# EAGLE design OscillatorShield (EAGLE 7.1.0)
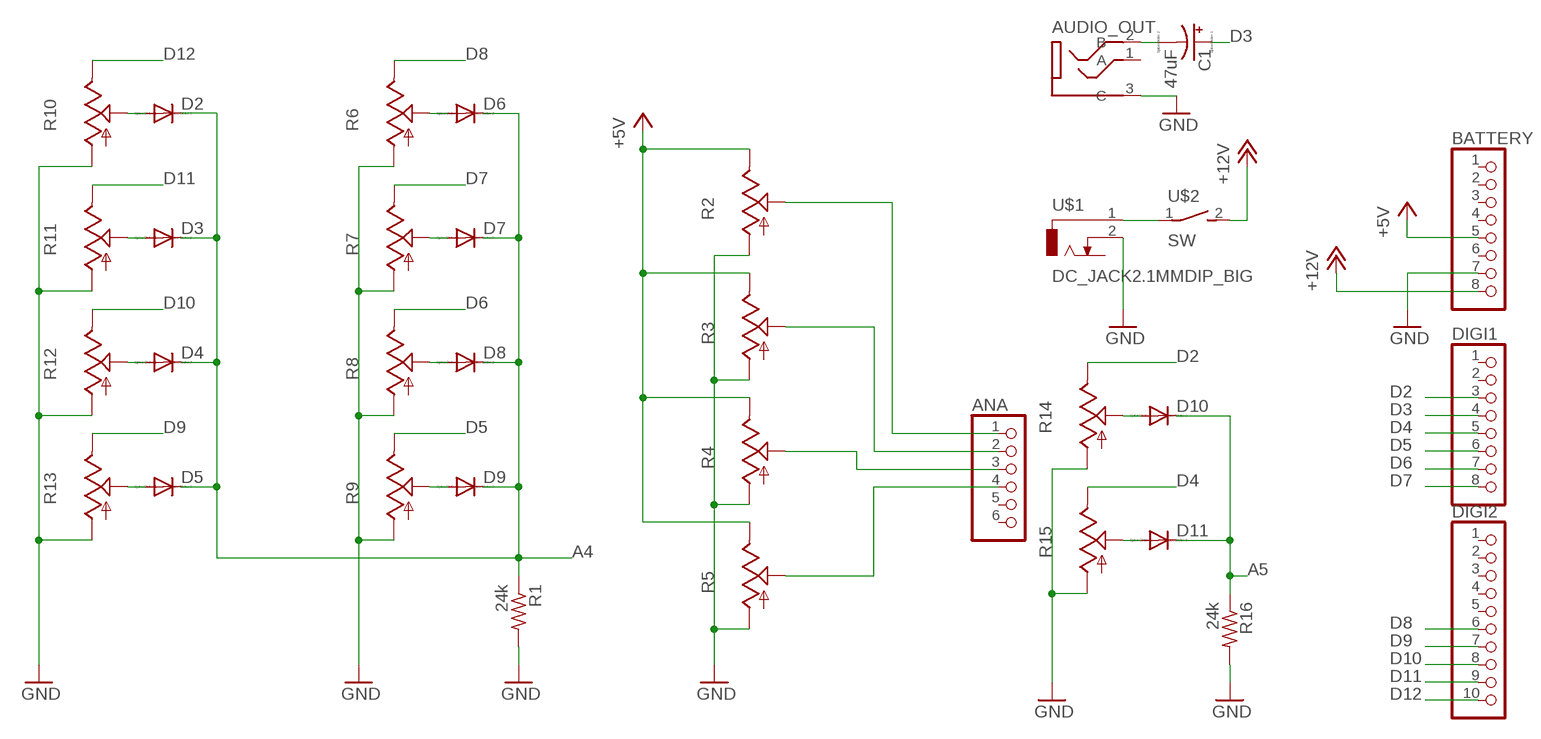
[diagram p0: schematic, sheet 1]

## Parts
ANA  PINHD-1X6  [1X06]
AUDIO_OUT  3CON_3.5MMPLUG  [3PIN_DIP]
BATTERY  PINHD-1X8  [1X08]
C1  47uF  CPOL-USE2.5-6  [E2,5-6]
D2  DIODE-SOD123  [SOD123]
D3  DIODE-SOD123  [SOD123]
D4  DIODE-SOD123  [SOD123]
D5  DIODE-SOD123  [SOD123]
D6  DIODE-SOD123  [SOD123]
D7  DIODE-SOD123  [SOD123]
D8  DIODE-SOD123  [SOD123]
D9  DIODE-SOD123  [SOD123]
D10  DIODE-SOD123  [SOD123]
D11  DIODE-SOD123  [SOD123]
DIGI1  PINHD-1X8  [1X08]
DIGI2  PINHD-1X10  [1X10]
R1  24k  R-US_R1206  [R1206]
R2  TRIM_US-RJ9W  [RJ9W]
R3  TRIM_US-RJ9W  [RJ9W]
R4  TRIM_US-RJ9W  [RJ9W]
R5  TRIM_US-RJ9W  [RJ9W]
R6  TRIM_US-RJ9W  [RJ9W]
R7  TRIM_US-RJ9W  [RJ9W]
R8  TRIM_US-RJ9W  [RJ9W]
R9  TRIM_US-RJ9W  [RJ9W]
R10  TRIM_US-RJ9W  [RJ9W]
R11  TRIM_US-RJ9W  [RJ9W]
R12  TRIM_US-RJ9W  [RJ9W]
R13  TRIM_US-RJ9W  [RJ9W]
R14  TRIM_US-RJ9W  [RJ9W]
R15  TRIM_US-RJ9W  [RJ9W]
R16  24k  R-US_R1206  [R1206]
U$1  DC_JACK2.1MMDIP_BIG  [2PIN_DIP_BIG]
U$2  SW  [2PIN_DIP_BIG]

## Nets
+5V: BATTERY.5 R2.E R3.E R4.E R5.E
+12V: BATTERY.8 U$2.2(S)
A4: D2.C D3.C D4.C D5.C D6.C D7.C D8.C D9.C R1.1
A5: D10.C D11.C R16.1
D2: DIGI1.3 R14.E
D3: C1.+ DIGI1.4
D4: DIGI1.5 R15.E
D5: DIGI1.6 R9.E
D6: DIGI1.7 R8.E
D7: DIGI1.8 R7.E
D8: DIGI2.6 R6.E
D9: DIGI2.7 R13.E
D10: DIGI2.8 R12.E
D11: DIGI2.9 R11.E
D12: DIGI2.10 R10.E
GND: AUDIO_OUT.3(C) BATTERY.7 R1.2 R2.A R3.A R4.A R5.A R6.A R7.A R8.A R9.A R10.A R11.A R12.A R13.A R14.A R15.A R16.2 U$1.2
N$1: ANA.1 R2.S
N$2: ANA.2 R3.S
N$3: ANA.3 R4.S
N$4: ANA.4 R5.S
N$5: D2.A R10.S
N$6: D3.A R11.S
N$7: D4.A R12.S
N$8: D5.A R13.S
N$9: D9.A R9.S
N$10: D8.A R8.S
N$11: D7.A R7.S
N$12: D6.A R6.S
N$13: AUDIO_OUT.2(B) C1.-
N$14: U$1.1 U$2.1(P)
N$17: D11.A R15.S
N$18: D10.A R14.S
Unconnected: ANA.5 ANA.6 AUDIO_OUT.1(A) BATTERY.1 BATTERY.2 BATTERY.3 BATTERY.4 BATTERY.6 DIGI1.1 DIGI1.2 DIGI2.1 DIGI2.2 DIGI2.3 DIGI2.4 DIGI2.5

## Library data of the parts
ANA = pinhead:PINHD-1X6: PIN HEADER
AUDIO_OUT = 02_MyOriginalLib:3CON_3.5MMPLUG
BATTERY DIGI1 = pinhead:PINHD-1X8: PIN HEADER
C1 = 01_EasyAccessLib:CPOL-US: POLARIZED CAPACITOR, American symbol
D2-D11 = 01_EasyAccessLib:DIODE-: DIODE
DIGI2 = pinhead:PINHD-1X10: PIN HEADER
R1 R16 = 01_EasyAccessLib:R-US_: RESISTOR, American symbol
R2-R15 = 01_EasyAccessLib:TRIM_US-: POTENTIOMETER
U$1 = 02_MyOriginalLib:DC_JACK2.1MM
U$2 = 02_MyOriginalLib:SW

## Board
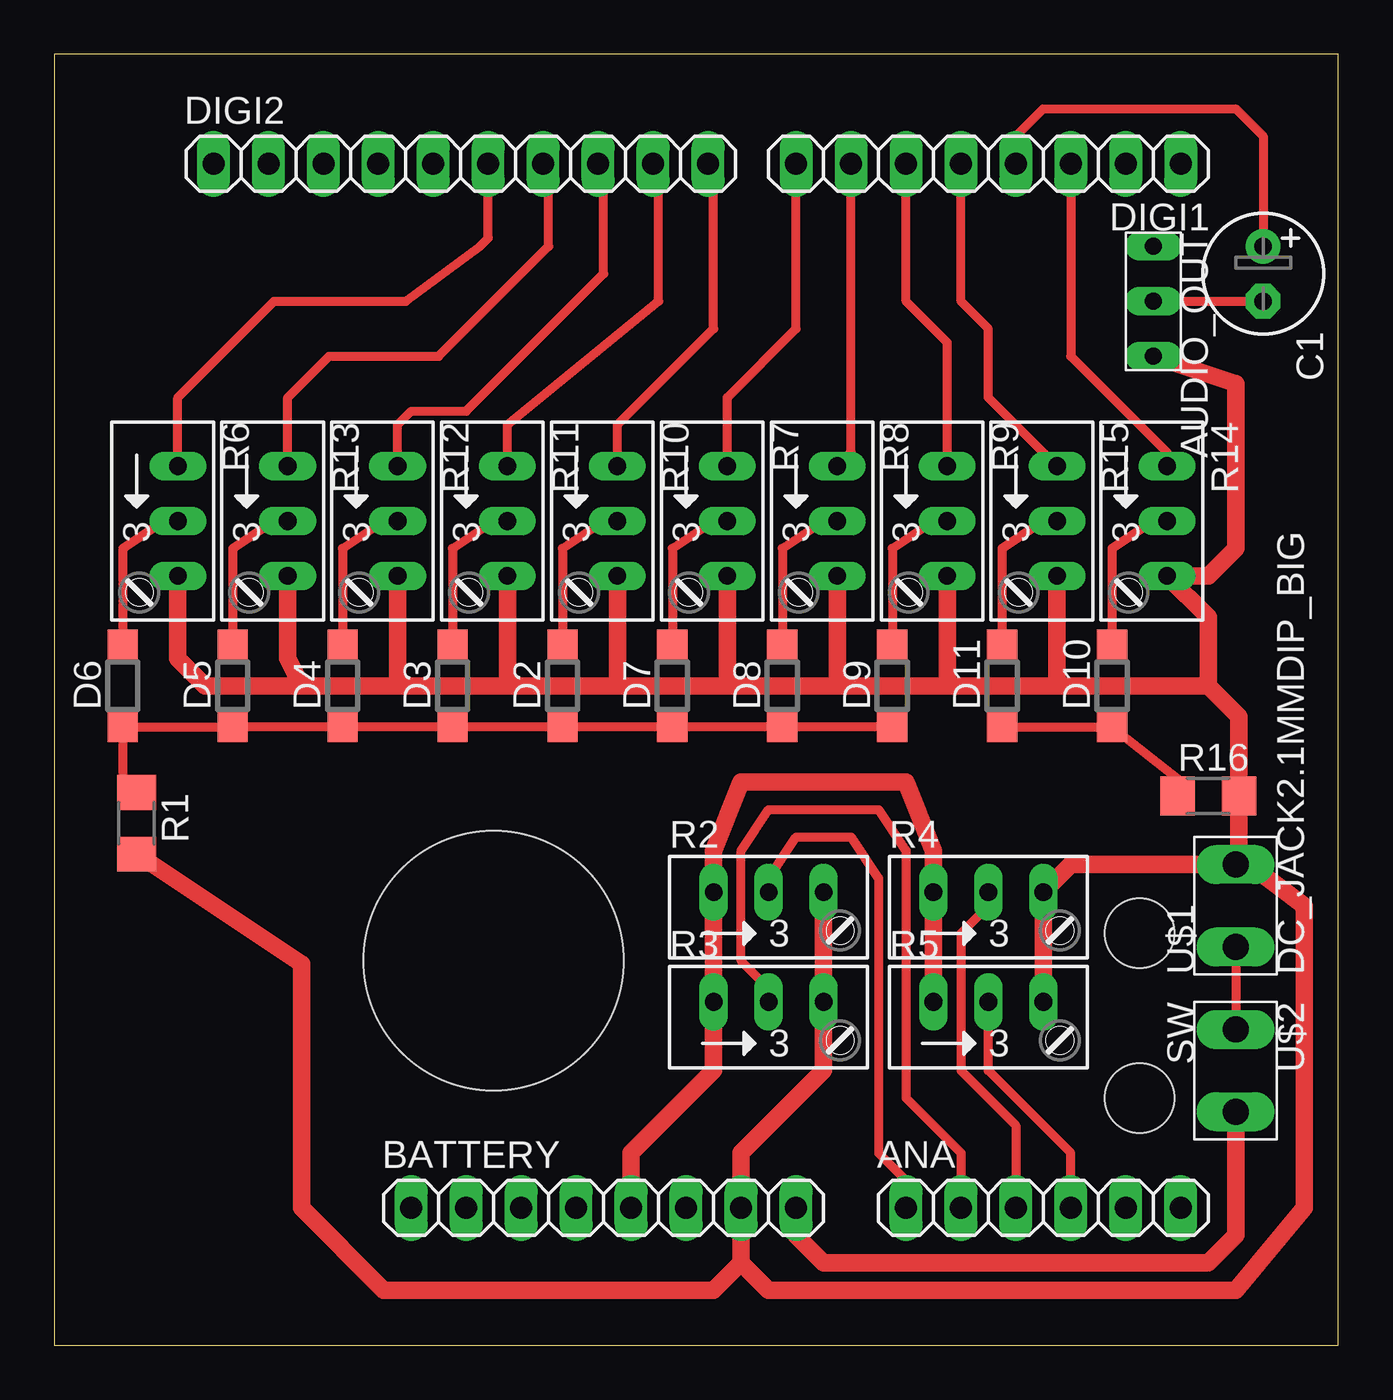
[diagram p1: board, top side]

Size 59.36 x 59.68 mm. Coordinates in mm from the lower left corner, seen from the top.
Outline: 0,0 59.36,0 59.36,59.68 0,59.68 0,0
Copper layers (1*16): Top 0.035mm / dielectric 1.5mm / Bottom 0.035mm
Design rules "default *": minimum track width 10mil, minimum drill 24mil, track to track 0.38mm, track to pad 0.38mm, pad to pad 0.38mm, via to via 0.38mm, smd to smd 0.38mm, copper to edge 40mil, drill to drill 8mil, minimum pad ring 10mil, minimum via ring 8mil, stop-mask expansion 4mil, vias tented up to drill 0mil, thermal gap 10mil
Holes 12 mm at 20.32,17.78
Holes 3.2 mm at 50.16,19.05 50.16,11.43

### Footprints (pad centres in the part's own frame; a part is rotated, then mirrored left to right if it is on the bottom)
1X06 = drill 1.016 long: 1 -6.35,0; 2 -3.81,0; 3 -1.27,0; 4 1.27,0; 5 3.81,0; 6 6.35,0
3PIN_DIP = drill 0.8 long: 1 -2.54,0; 2 0,0; 3 2.54,0
1X08 = drill 1.016 long: 1 -8.89,0; 2 -6.35,0; 3 -3.81,0; 4 -1.27,0; 5 1.27,0; 6 3.81,0; 7 6.35,0; 8 8.89,0
E2,5-6 = drill 0.813 pad 1.6: + -1.27,0 | drill 0.813 pad 1.6 octagon: - 1.27,0
SOD123 = smd 1.4 x 1.4: A 1.9,0; C -1.9,0
1X10 = drill 1.016 long: 1 -11.43,0; 2 -8.89,0; 3 -6.35,0; 4 -3.81,0; 5 -1.27,0; 6 1.27,0; 7 3.81,0; 8 6.35,0; 9 8.89,0; 10 11.43,0
R1206 = smd 1.6 x 1.803: 1 -1.422,0; 2 1.422,0
RJ9W = drill 0.813 long: A 2.54,0.635; E -2.54,0.635; S 0,0.635
2PIN_DIP_BIG = drill 1.2 long: 1 -1.905,0; 2 1.905,0

### Placement (x,y rotation side)
ANA  45.72,6.35 0 top
AUDIO_OUT  50.8,48.26 270 top
BATTERY  25.4,6.35 0 top
C1  55.88,49.53 270 top
D2  23.5,30.48 90 top
D3  18.41,30.48 90 top
D4  13.34,30.48 90 top
D5  8.26,30.48 90 top
D6  3.17,30.48 90 top
D7  28.57,30.48 90 top
D8  33.66,30.48 90 top
D9  38.73,30.48 90 top
D10  48.9,30.48 90 top
D11  43.81,30.48 90 top
DIGI1  43.18,54.61 180 top
DIGI2  18.8,54.61 0 top
R1  3.81,24.13 270 top
R2  33.02,20.32 0 top
R3  33.02,15.24 0 top
R4  43.18,20.32 0 top
R5  43.18,15.24 0 top
R6  5.08,38.1 270 top
R7  30.48,38.1 270 top
R8  35.56,38.1 270 top
R9  40.64,38.1 270 top
R10  25.4,38.1 270 top
R11  20.32,38.1 270 top
R12  15.24,38.1 270 top
R13  10.16,38.1 270 top
R14  50.8,38.1 270 top
R15  45.72,38.1 270 top
R16  53.34,25.4 0 top
U$1  54.61,20.32 90 top
U$2  54.61,12.7 270 top

### Tracks (layer width: path | path; a pad name or v marks a point on that pad's centre or on a via)
+5V
  Top 0.813: R5.E R4.E 40.64,22.86 39.37,26.04 31.75,26.04 30.48,22.86 R2.E R3.E 30.48,12.7 26.67,8.89 BATTERY.5
+12V
  Top 0.406: 34.29,5.08 BATTERY.8
  Top 0.813: U$2.2 54.61,5.08 53.34,3.81 35.56,3.81 34.29,5.08
A4
  Top 0.406: D9.C D8.C D7.C D2.C D3.C D4.C D5.C D6.C 3.17,26.19 R1.1
A5
  Top 0.406: D11.C D10.C 51.92,26.19 R16.1
D2
  Top 0.406: R14.E 51.44,41.27 46.99,45.72 DIGI1.3
D3
  Top 0.406: DIGI1.4 44.45,55.88 45.72,57.15 54.61,57.15 55.88,55.88 C1.+
D4
  Top 0.406: R15.E 43.18,43.81 43.18,46.99 41.91,48.26 DIGI1.5
D5
  Top 0.406: R9.E 41.27,46.35 39.37,48.26 DIGI1.6
D6
  Top 0.406: R8.E 36.83,41.27 DIGI1.7
D7
  Top 0.406: R7.E 31.11,43.81 34.29,46.99 DIGI1.8
D8
  Top 0.406: R6.E 5.71,43.81 10.16,48.26 16.26,48.26 19.68,50.8 20.07,51.18 DIGI2.6
D9
  Top 0.406: R13.E 10.79,43.81 12.7,45.72 17.78,45.72 22.86,50.8 22.86,54.36 DIGI2.7
D10
  Top 0.406: R12.E 15.88,42.55 16.51,43.18 19.05,43.18 25.4,49.53 25.4,54.36 DIGI2.8
D11
  Top 0.406: R11.E 20.95,42.55 27.94,48.26 27.94,54.36 DIGI2.9
D12
  Top 0.406: R10.E 26.04,42.55 30.48,46.99 30.48,54.36 DIGI2.10
GND
  Top 0.406: 55.24,22.23 U$1.2 54.76,22.38
  Top 0.813: 31.75,3.81 BATTERY.7 31.75,8.89 35.56,12.7 R3.A R2.A | 31.75,3.81 30.48,2.54 15.24,2.54 11.43,6.35 11.43,17.63 R1.2 | R5.A R4.A 46.99,22.23 U$1.2 | 55.24,22.23 57.78,20.32 57.78,6.35 54.61,2.54 33.02,2.54 31.75,3.81 | 11.43,30.48 15.88,30.48 | 15.88,30.48 20.95,30.48 | 20.95,30.48 26.04,30.48 | 26.04,30.48 31.11,30.48 | 31.11,30.48 36.2,30.48 | 36.2,30.48 41.27,30.48 | 41.27,30.48 46.35,30.48 | 46.35,30.48 53.34,30.48 | 53.34,30.48 54.76,29.06 R16.2 54.76,22.38 | R13.A 10.79,31.75 11.43,30.48 | R12.A 15.88,30.48 | R11.A 20.95,30.48 | R10.A 26.04,30.48 | R7.A 31.11,30.48 | R8.A 36.2,30.48 | R9.A 41.27,30.48 | R15.A 46.35,30.48 | 53.34,30.48 53.34,33.66 R14.A 53.34,35.56 54.61,36.83 54.61,44.45 AUDIO_OUT.3 | 11.43,30.48 6.99,30.48 5.71,31.75 R6.A
N$1
  Top 0.406: R2.S 33.02,21.59 34.29,23.5 36.83,23.5 38.1,21.59 38.1,8.89 39.37,7.62 ANA.1
N$2
  Top 0.406: R3.S 33.02,16.51 31.75,17.78 31.75,22.86 33.02,24.77 38.1,24.77 39.37,22.86 39.37,11.43 41.91,8.89 ANA.2
N$3
  Top 0.406: R4.S 43.18,20.32 41.91,19.05 41.91,12.7 44.45,10.16 ANA.3
N$4
  Top 0.406: ANA.4 46.99,8.89 43.18,12.7 R5.S
N$5
  Top 0.406: R10.S 25.4,38.1 23.5,36.83 D2.A
N$6
  Top 0.406: R11.S 20.32,38.1 18.41,36.83 D3.A
N$7
  Top 0.406: R12.S 15.24,38.1 13.34,36.83 D4.A
N$8
  Top 0.406: R13.S 10.16,38.1 8.26,36.83 D5.A
N$9
  Top 0.406: R9.S 40.64,38.1 38.73,36.83 D9.A
N$10
  Top 0.406: R8.S 35.56,38.1 33.66,36.83 D8.A
N$11
  Top 0.406: R7.S 30.48,38.1 28.57,36.83 D7.A
N$12
  Top 0.406: R6.S 5.08,38.1 3.17,36.83 D6.A
N$13
  Top 0.406: AUDIO_OUT.2 C1.-
N$14
  Top 0.406: U$1.1 U$2.1
N$17
  Top 0.406: R15.S 45.72,38.1 43.81,36.83 D11.A
N$18
  Top 0.406: R14.S 50.8,38.1 48.9,36.83 D10.A